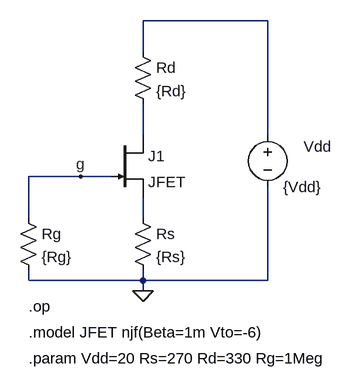
[diagram p0: schematic FET02op.asc]
FET02op.asc, the LTspice schematic file:
Version 4
SHEET 1 1608 1076
WIRE 384 -128 192 -128
WIRE 192 -80 192 -128
WIRE 192 48 192 0
WIRE 384 48 384 -128
WIRE 96 112 16 112
WIRE 144 112 96 112
WIRE 16 176 16 112
WIRE 192 176 192 144
WIRE 16 272 16 256
WIRE 192 272 192 256
WIRE 192 272 16 272
WIRE 384 272 384 128
WIRE 384 272 192 272
WIRE 192 288 192 272
FLAG 192 288 0
FLAG 96 112 g
SYMBOL njf 144 48 R0
SYMATTR InstName J1
SYMATTR Value JFET
SYMBOL voltage 384 32 R0
WINDOW 0 55 34 Left 2
WINDOW 123 0 0 Left 0
WINDOW 39 0 0 Left 0
SYMATTR InstName Vdd
SYMATTR Value {Vdd}
SYMBOL res 176 -96 R0
SYMATTR InstName Rd
SYMATTR Value {Rd}
SYMBOL res 176 160 R0
SYMATTR InstName Rs
SYMATTR Value {Rs}
SYMBOL res 0 160 R0
SYMATTR InstName Rg
SYMATTR Value {Rg}
TEXT 16 312 Left 2 !.op
TEXT 16 352 Left 2 !.model JFET njf(Beta=1m Vto=-6)
TEXT 16 392 Left 2 !.param Vdd=20 Rs=270 Rd=330 Rg=1Meg

The netlist it stands for:
* FET02op.asc
J1 N002 g N003 JFET
Vdd N001 0 {Vdd}
Rd N001 N002 {Rd}
Rs N003 0 {Rs}
Rg g 0 {Rg}
.model NJF NJF
.model PJF PJF
.lib standard.jft
.op
.model JFET njf(Beta=1m Vto=-6)
.param Vdd=20 Rs=270 Rd=330 Rg=1Meg
.backanno
.end